# EAGLE schematic LEDCube (EAGLE 7.2.0)
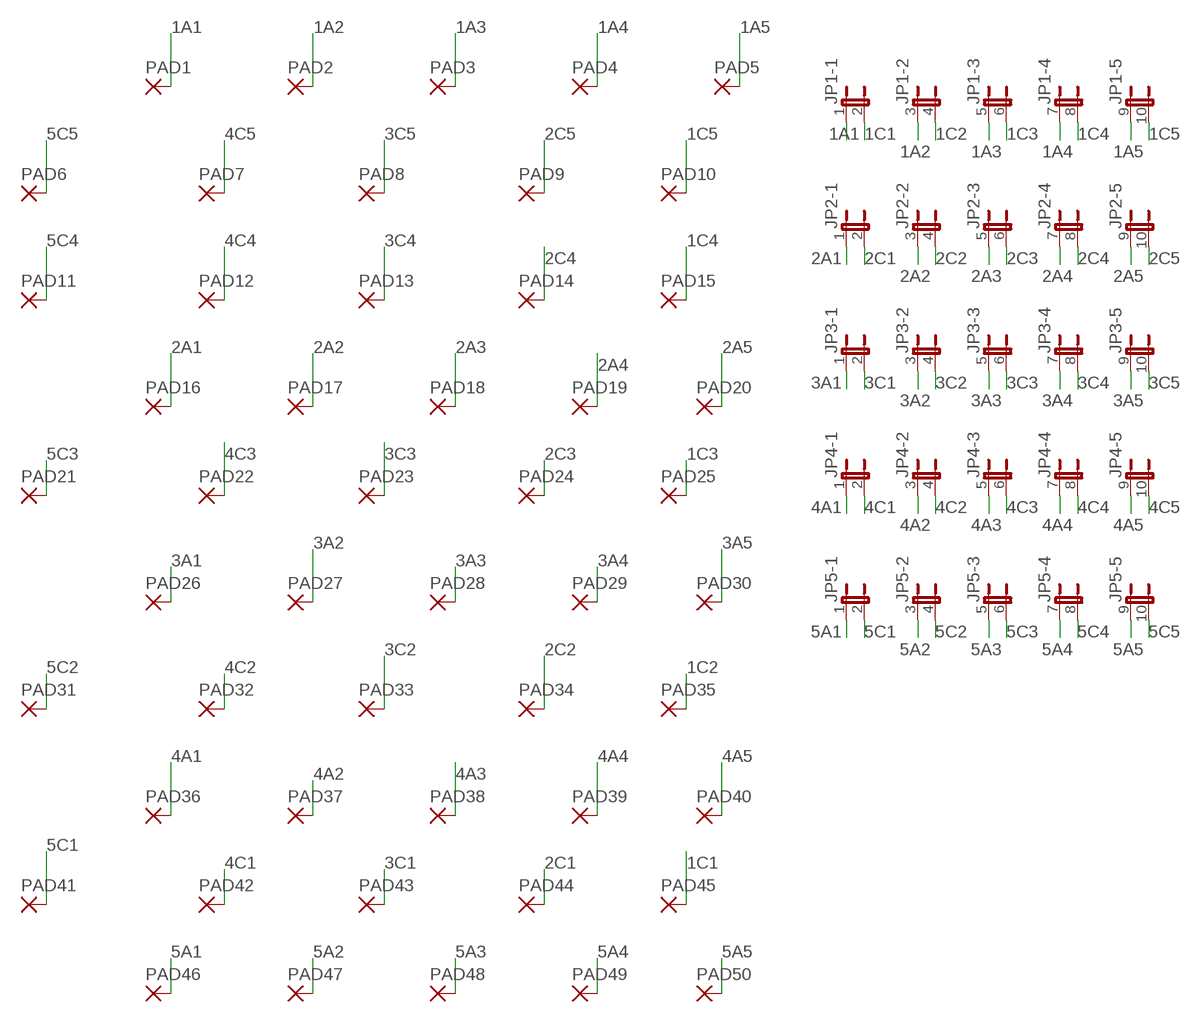
[diagram p0: schematic, sheet 1]

## Parts
JP1  JP5QE  [JP5Q]
JP2  JP5QE  [JP5Q]
JP3  JP5QE  [JP5Q]
JP4  JP5QE  [JP5Q]
JP5  JP5QE  [JP5Q]
PAD1  2,54/1,1  [2,54/1,1]
PAD2  2,54/1,1  [2,54/1,1]
PAD3  2,54/1,1  [2,54/1,1]
PAD4  2,54/1,1  [2,54/1,1]
PAD5  2,54/1,1  [2,54/1,1]
PAD6  2,54/1,1  [2,54/1,1]
PAD7  2,54/1,1  [2,54/1,1]
PAD8  2,54/1,1  [2,54/1,1]
PAD9  2,54/1,1  [2,54/1,1]
PAD10  2,54/1,1  [2,54/1,1]
PAD11  2,54/1,1  [2,54/1,1]
PAD12  2,54/1,1  [2,54/1,1]
PAD13  2,54/1,1  [2,54/1,1]
PAD14  2,54/1,1  [2,54/1,1]
PAD15  2,54/1,1  [2,54/1,1]
PAD16  2,54/1,1  [2,54/1,1]
PAD17  2,54/1,1  [2,54/1,1]
PAD18  2,54/1,1  [2,54/1,1]
PAD19  2,54/1,1  [2,54/1,1]
PAD20  2,54/1,1  [2,54/1,1]
PAD21  2,54/1,1  [2,54/1,1]
PAD22  2,54/1,1  [2,54/1,1]
PAD23  2,54/1,1  [2,54/1,1]
PAD24  2,54/1,1  [2,54/1,1]
PAD25  2,54/1,1  [2,54/1,1]
PAD26  2,54/1,1  [2,54/1,1]
PAD27  2,54/1,1  [2,54/1,1]
PAD28  2,54/1,1  [2,54/1,1]
PAD29  2,54/1,1  [2,54/1,1]
PAD30  2,54/1,1  [2,54/1,1]
PAD31  2,54/1,1  [2,54/1,1]
PAD32  2,54/1,1  [2,54/1,1]
PAD33  2,54/1,1  [2,54/1,1]
PAD34  2,54/1,1  [2,54/1,1]
PAD35  2,54/1,1  [2,54/1,1]
PAD36  2,54/1,1  [2,54/1,1]
PAD37  2,54/1,1  [2,54/1,1]
PAD38  2,54/1,1  [2,54/1,1]
PAD39  2,54/1,1  [2,54/1,1]
PAD40  2,54/1,1  [2,54/1,1]
PAD41  2,54/1,1  [2,54/1,1]
PAD42  2,54/1,1  [2,54/1,1]
PAD43  2,54/1,1  [2,54/1,1]
PAD44  2,54/1,1  [2,54/1,1]
PAD45  2,54/1,1  [2,54/1,1]
PAD46  2,54/1,1  [2,54/1,1]
PAD47  2,54/1,1  [2,54/1,1]
PAD48  2,54/1,1  [2,54/1,1]
PAD49  2,54/1,1  [2,54/1,1]
PAD50  2,54/1,1  [2,54/1,1]

## Nets
1A1: JP1.1 PAD1.1(P)
1A2: JP1.3 PAD2.1(P)
1A3: JP1.5 PAD3.1(P)
1A4: JP1.7 PAD4.1(P)
1A5: JP1.9 PAD5.1(P)
1C1: JP1.2 PAD45.1(P)
1C2: JP1.4 PAD35.1(P)
1C3: JP1.6 PAD25.1(P)
1C4: JP1.8 PAD15.1(P)
1C5: JP1.10 PAD10.1(P)
2A1: JP2.1 PAD16.1(P)
2A2: JP2.3 PAD17.1(P)
2A3: JP2.5 PAD18.1(P)
2A4: JP2.7 PAD19.1(P)
2A5: JP2.9 PAD20.1(P)
2C1: JP2.2 PAD44.1(P)
2C2: JP2.4 PAD34.1(P)
2C3: JP2.6 PAD24.1(P)
2C4: JP2.8 PAD14.1(P)
2C5: JP2.10 PAD9.1(P)
3A1: JP3.1 PAD26.1(P)
3A2: JP3.3 PAD27.1(P)
3A3: JP3.5 PAD28.1(P)
3A4: JP3.7 PAD29.1(P)
3A5: JP3.9 PAD30.1(P)
3C1: JP3.2 PAD43.1(P)
3C2: JP3.4 PAD33.1(P)
3C3: JP3.6 PAD23.1(P)
3C4: JP3.8 PAD13.1(P)
3C5: JP3.10 PAD8.1(P)
4A1: JP4.1 PAD36.1(P)
4A2: JP4.3 PAD37.1(P)
4A3: JP4.5 PAD38.1(P)
4A4: JP4.7 PAD39.1(P)
4A5: JP4.9 PAD40.1(P)
4C1: JP4.2 PAD42.1(P)
4C2: JP4.4 PAD32.1(P)
4C3: JP4.6 PAD22.1(P)
4C4: JP4.8 PAD12.1(P)
4C5: JP4.10 PAD7.1(P)
5A1: JP5.1 PAD46.1(P)
5A2: JP5.3 PAD47.1(P)
5A3: JP5.5 PAD48.1(P)
5A4: JP5.7 PAD49.1(P)
5A5: JP5.9 PAD50.1(P)
5C1: JP5.2 PAD41.1(P)
5C2: JP5.4 PAD31.1(P)
5C3: JP5.6 PAD21.1(P)
5C4: JP5.8 PAD11.1(P)
5C5: JP5.10 PAD6.1(P)

## Library data of the parts
JP1-JP5 = jumper:JP5QE: JUMPER
PAD1-PAD50 = wirepad:2,54/1,1: THROUGH-HOLE PAD